# Altium schematic sheet 13_SPI_Flash.SchDoc
size A4
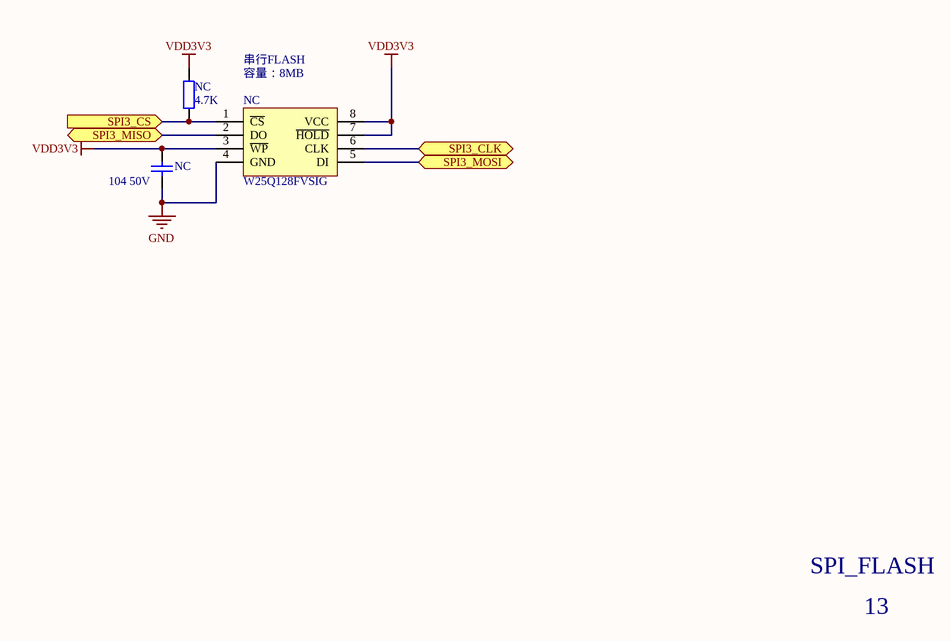
[diagram p0: 13_SPI_Flash.SchDoc]

## Parts
(Parts that share a designator on the sheet are numbered #1, #2 ... from top to bottom, then left to right.)
NC#1  4.7K  [SMD-0603]
NC#2  W25Q128FVSIG  [SO-8W]
NC#3  104 50V  [SMD-0603C]

## Ports
SPI3_CLK (bidir), SPI3_CS (in), SPI3_MISO (bidir), SPI3_MOSI (bidir)

## Nets
GND: NC#2.4(GND) NC#3.2
VDD3V3: NC#1.1 NC#2.3(~{WP}) NC#2.7(~{HOLD}) NC#2.8(VCC) NC#3.1
SPI3_CLK: NC#2.6(CLK) ; port SPI3_CLK
SPI3_CS: NC#1.2 NC#2.1(~{CS}) ; port SPI3_CS
SPI3_MISO: NC#2.2(DO) ; port SPI3_MISO
SPI3_MOSI: NC#2.5(DI) ; port SPI3_MOSI

## Notes on the sheet
- 串行FLASH
- (near NC#2) 容量：8MB
- SPI_FLASH
- 13

## Library data of the parts
NC#1 = RES2: 贴片电阻 5%
NC#2 = W25Q128FV
NC#3 = CAP4: 贴片电容 20%